# EAGLE design AkhilMini (EAGLE 8.6.0)
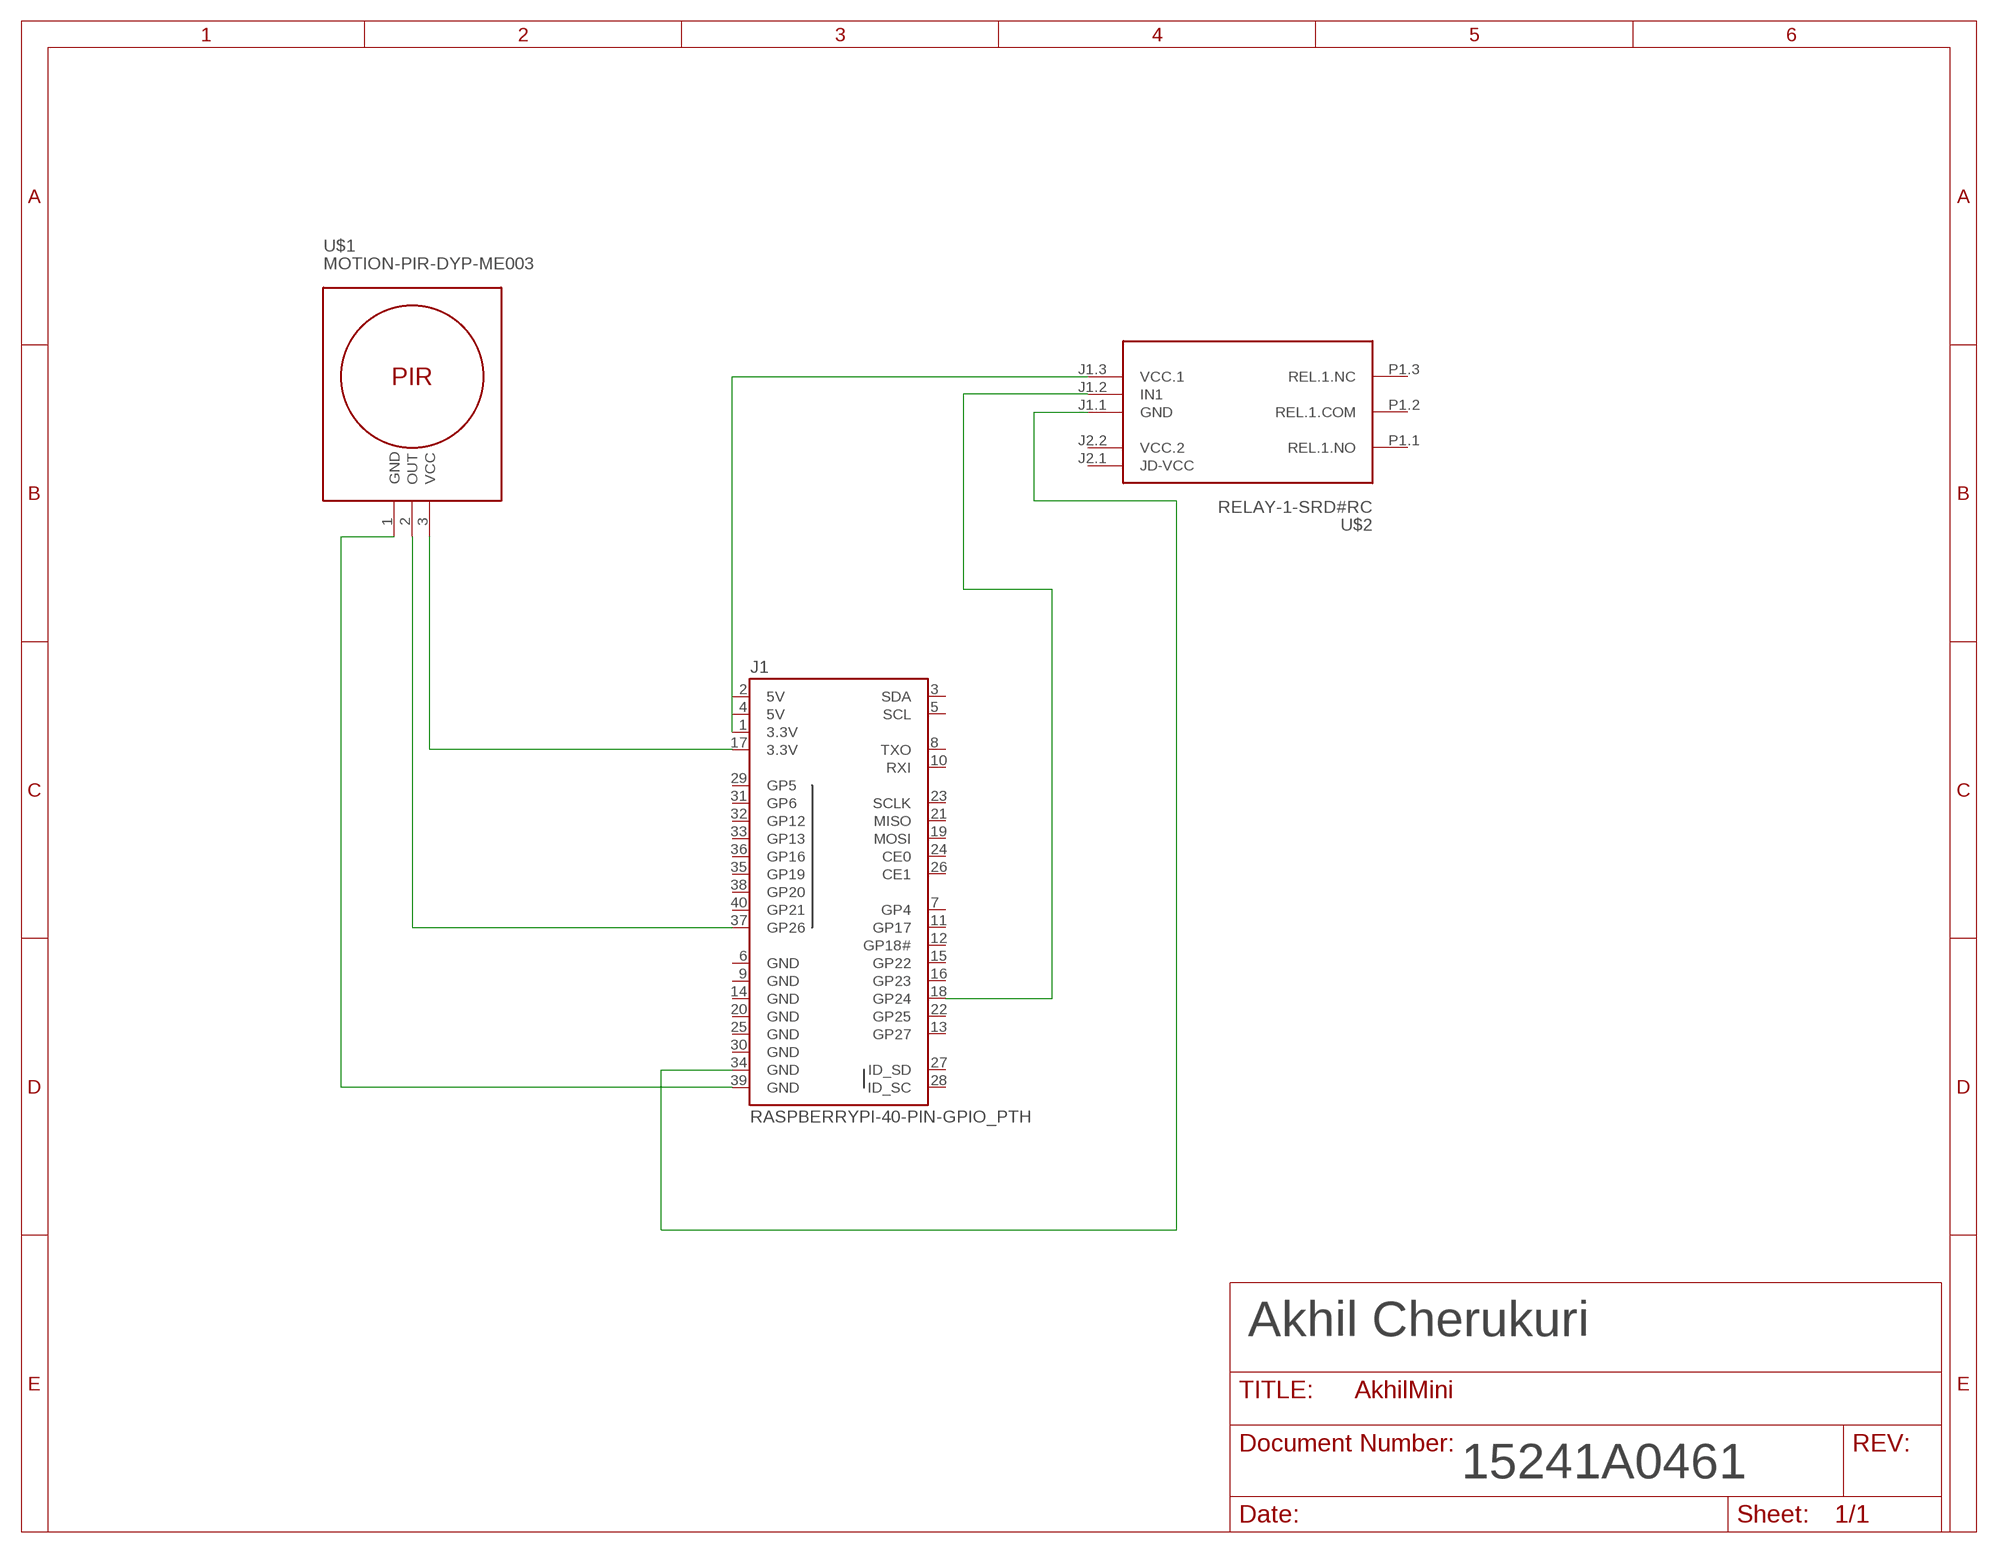
[diagram p0: schematic, sheet 1]

## Parts
J1  RASPBERRYPI-40-PIN-GPIO_PTH  [2X20_SHROUDED]
U$1  MOTION-PIR-DYP-ME003  [MOTION-PIR-DYP-ME003]
U$2  RELAY-1-SRD#RC  [RELAY-1-SRD#RC]

## Nets
N$1: J1.17(3.3V) U$1.3(VCC)
N$2: J1.1(3.3V) U$2.J1.3(VCC.1)
N$3: J1.34(GND) U$2.J1.1(GND)
N$4: J1.39(GND) U$1.1(GND)
N$5: J1.37(GP26) U$1.2(OUT)
N$6: J1.18(GP24) U$2.J1.2(IN1)
Unconnected: J1.3(SDA) J1.5(SCL) J1.7(GP4) J1.8(TXO) J1.10(RXI) J1.11(GP17) J1.12(GP18#) J1.13(GP27) J1.15(GP22) J1.16(GP23) J1.19(MOSI) J1.21(MISO) J1.22(GP25) J1.23(SCLK) J1.24(CE0) J1.26(CE1) J1.27(ID_SD) J1.28(ID_SC) J1.29(GP5) J1.31(GP6) J1.32(GP12) J1.33(GP13) J1.35(GP19) J1.36(GP16) J1.38(GP20) J1.40(GP21) U$2.J2.1(JD-VCC) U$2.P1.1(REL.1.NO) U$2.P1.2(REL.1.COM) U$2.P1.3(REL.1.NC)

## Notes on the sheet
- Akhil Cherukuri
- 15241A0461

## Power pins joined to a net without a drawn wire
5V: J1.2(5V) J1.4(5V)
GND: J1.6(GND) J1.9(GND) J1.14(GND) J1.20(GND) J1.25(GND) J1.30(GND)
VCC.2: U$2.J2.2(VCC.2)

## Library data of the parts
J1 = SparkFun-Connectors:RASPBERRYPI-40-PIN-GPIO: Raspberry Pi GPIO Header 2x20 pin connector, as found on B, B+, A+ models. Both shrouded PTH and SMT versions available. SparkFun Products: GPIO Shrouded Header <https://www.sparkfun.com/products/13054>- PTH SparkFun Pi Wedge (Preassembled) <https://www.sparkfun.com/products/13717>; PROD_ID: CONN-12263; SF_ID: PRT-13054
U$1 = diy-modules:MOTION-PIR-DYP-ME003: PIR Motion Sensor Module DYP-ME003 based on BISS0001 pyroelectic detector Click here to find device on ebay.com <http://www.ebay.com/sch/dyp+me003>
U$2 = diy-modules:RELAY-1-SRD#RC: 1-Channel Relay Module based on SRD-05VDC-SL-C relays Symbol with relays pins Click here to find device on ebay.com <http://www.ebay.com/sch/one+channel+isolated+relay+5v>

## Board
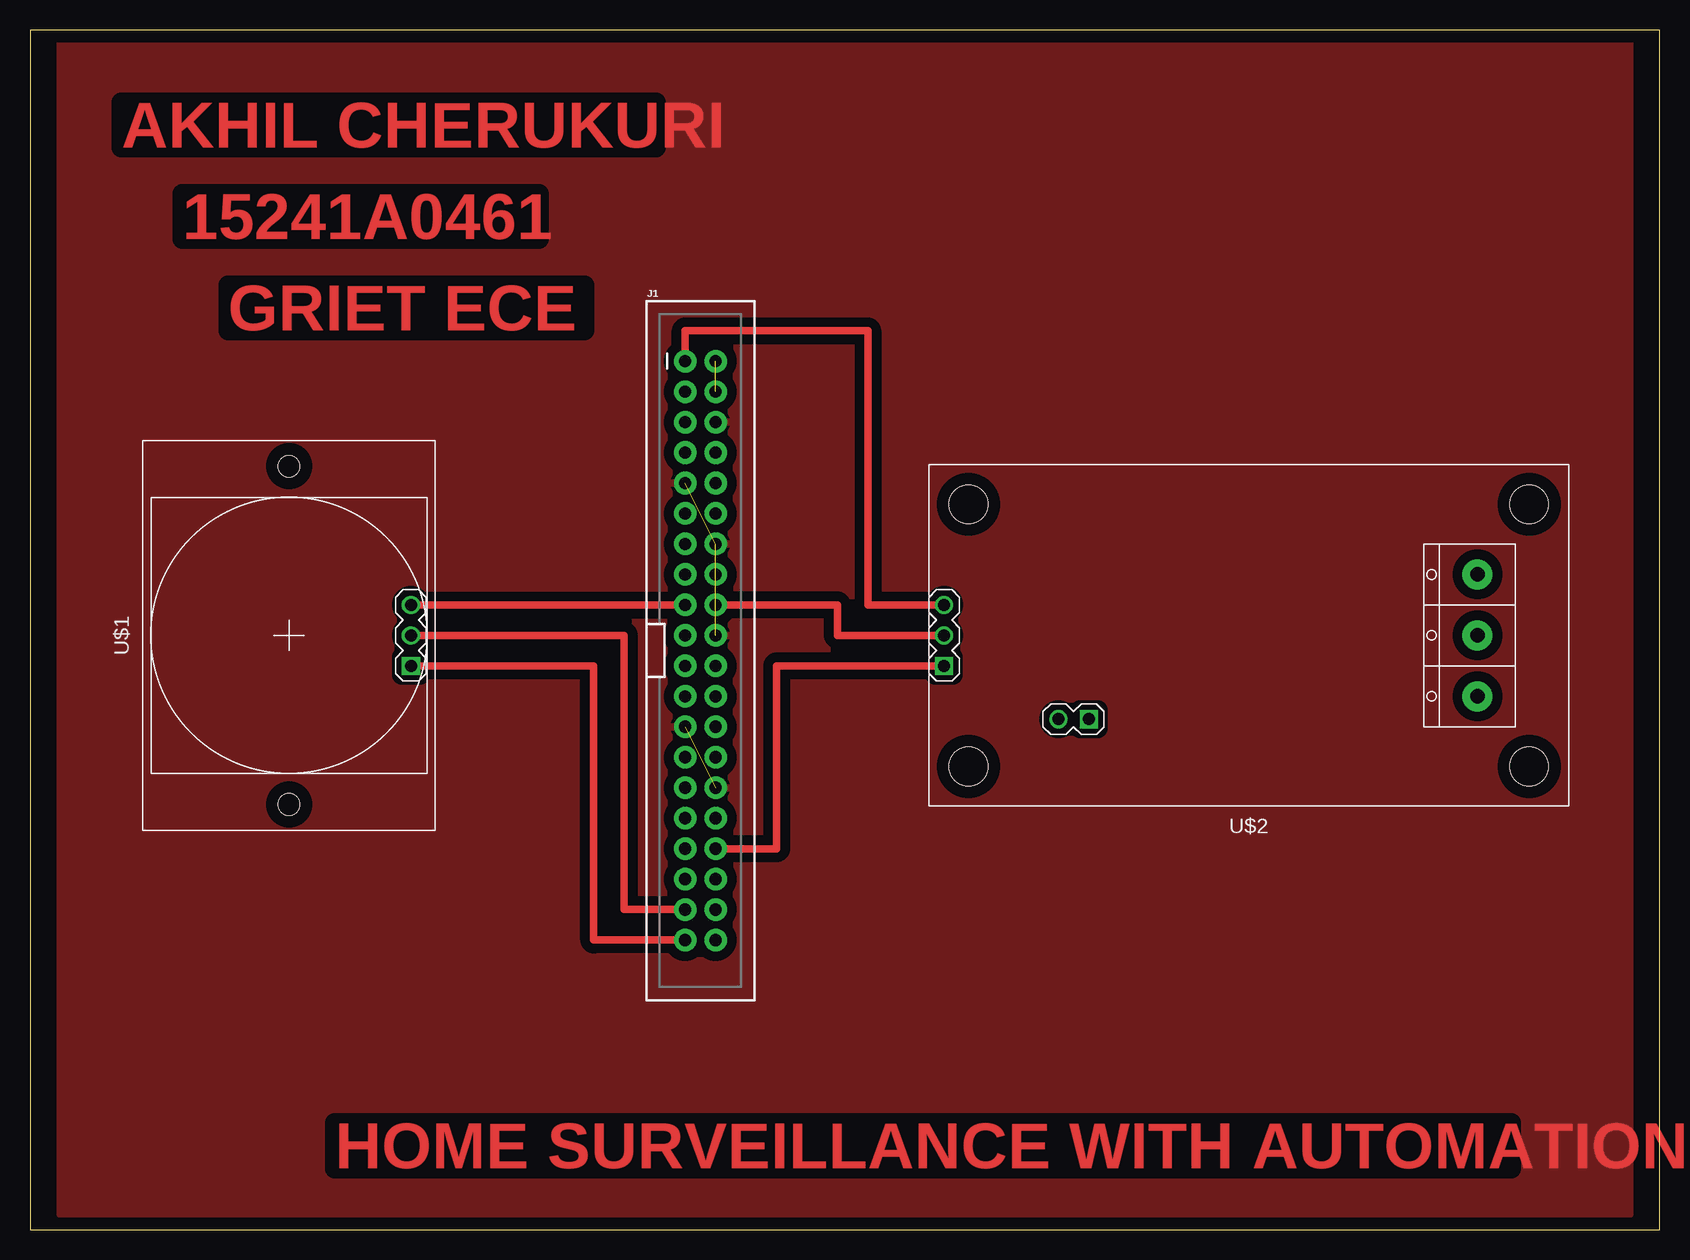
[diagram p1: board, top side]
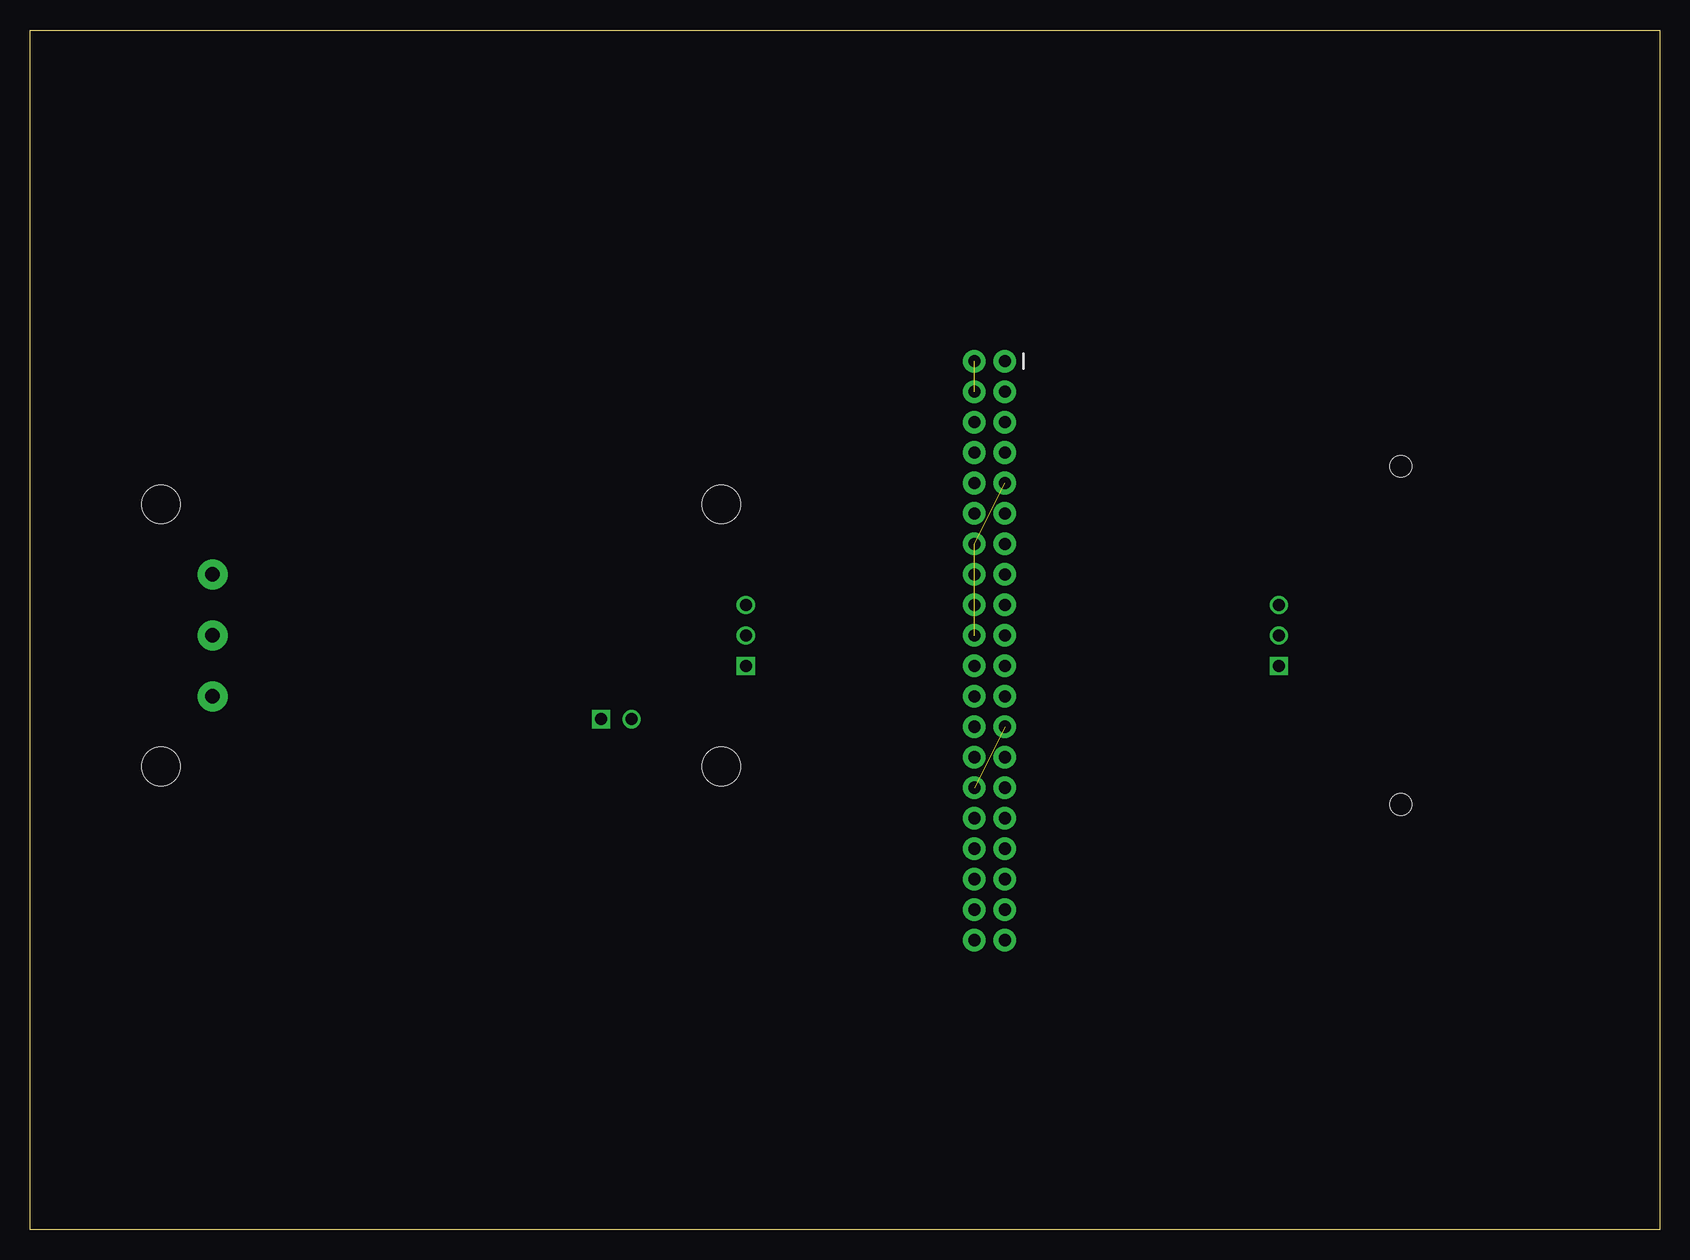
[diagram p2: board, bottom side, seen from below]

Size 135.87 x 100 mm. Coordinates in mm from the lower left corner, seen from the top.
Outline: 0,0 135.87,0 135.87,100 0,100 0,0
Copper layers (1*16): Top 0.035mm / dielectric 1.5mm / Bottom 0.035mm
Design rules "default": minimum track width 6mil, minimum drill 0.35mm, track to track 6mil, track to pad 6mil, pad to pad 6mil, via to via 6mil, smd to smd 6mil, copper to edge 40mil, drill to drill 6mil, minimum pad ring 10mil, minimum via ring 8mil, stop-mask expansion 4mil, vias tented up to drill 0mil, thermal gap 10mil

### Footprints (pad centres in the part's own frame; a part is rotated, then mirrored left to right if it is on the bottom)
2X20_SHROUDED = drill 1.016 pad 1.88: 1 -1.27,24.13; 2 1.27,24.13; 3 -1.27,21.59; 4 1.27,21.59; 5 -1.27,19.05; 6 1.27,19.05; 7 -1.27,16.51; 8 1.27,16.51; 9 -1.27,13.97; 10 1.27,13.97; 11 -1.27,11.43; 12 1.27,11.43; 13 -1.27,8.89; 14 1.27,8.89; 15 -1.27,6.35; 16 1.27,6.35; 17 -1.27,3.81; 18 1.27,3.81; 19 -1.27,1.27; 20 1.27,1.27; 21 -1.27,-1.27; 22 1.27,-1.27; 23 -1.27,-3.81; 24 1.27,-3.81; 25 -1.27,-6.35; 26 1.27,-6.35; 27 -1.27,-8.89; 28 1.27,-8.89; 29 -1.27,-11.43; 30 1.27,-11.43; 31 -1.27,-13.97; 32 1.27,-13.97; 33 -1.27,-16.51; 34 1.27,-16.51; 35 -1.27,-19.05; 36 1.27,-19.05; 37 -1.27,-21.59; 38 1.27,-21.59; 39 -1.27,-24.13; 40 1.27,-24.13
MOTION-PIR-DYP-ME003 = drill 1 square: 1 -2.54,-10.16 | drill 1: 2 0,-10.16; 3 2.54,-10.16 | hole 1.8: -14.1,0; 14.1,0
RELAY-1-SRD#RC = drill 1 square: J1.1 25.4,2.54; J2.1 13.335,6.985 | drill 1: J1.2 25.4,0; J1.3 25.4,-2.54; J2.2 15.875,6.985 | drill 1.2 pad 2.5: P1.1 -19.05,5.08; P1.2 -19.05,0; P1.3 -19.05,-5.08 | hole 3.2: -23.368,10.922; 23.368,10.922; 23.368,-10.922; -23.368,-10.922

### Placement (x,y rotation side)
J1  55.88,48.26 0 top
U$1  21.59,49.53 90 top
U$2  101.6,49.53 180 top

### Tracks (layer width: path | path; a pad name or v marks a point on that pad's centre or on a via)
5V  (1 unrouted)
GND  (3 unrouted)
  pour Top (isolate 0.813): 2.54,99.06 133.35,99.06 133.35,1.27 2.54,1.27
N$1
  Top 0.61: U$1.3 J1.17
N$2
  Top 0.61: J1.1 54.61,74.93 69.85,74.93 69.85,52.07 U$2.J1.3
N$3
  Top 0.61: U$2.J1.1 62.23,46.99 62.23,31.75 J1.34
N$4
  Top 0.61: J1.39 46.99,24.13 46.99,46.99 U$1.1
N$5
  Top 0.61: U$1.2 49.53,49.53 49.53,26.67 J1.37
N$6
  Top 0.61: U$2.J1.2 67.31,49.53 67.31,52.07 J1.18

### Text on the board
Top: AKHIL CHERUKURI | 15241A0461 | GRIET ECE | HOME SURVEILLANCE WITH AUTOMATION